# Altium project ESP6266.PrjPcb
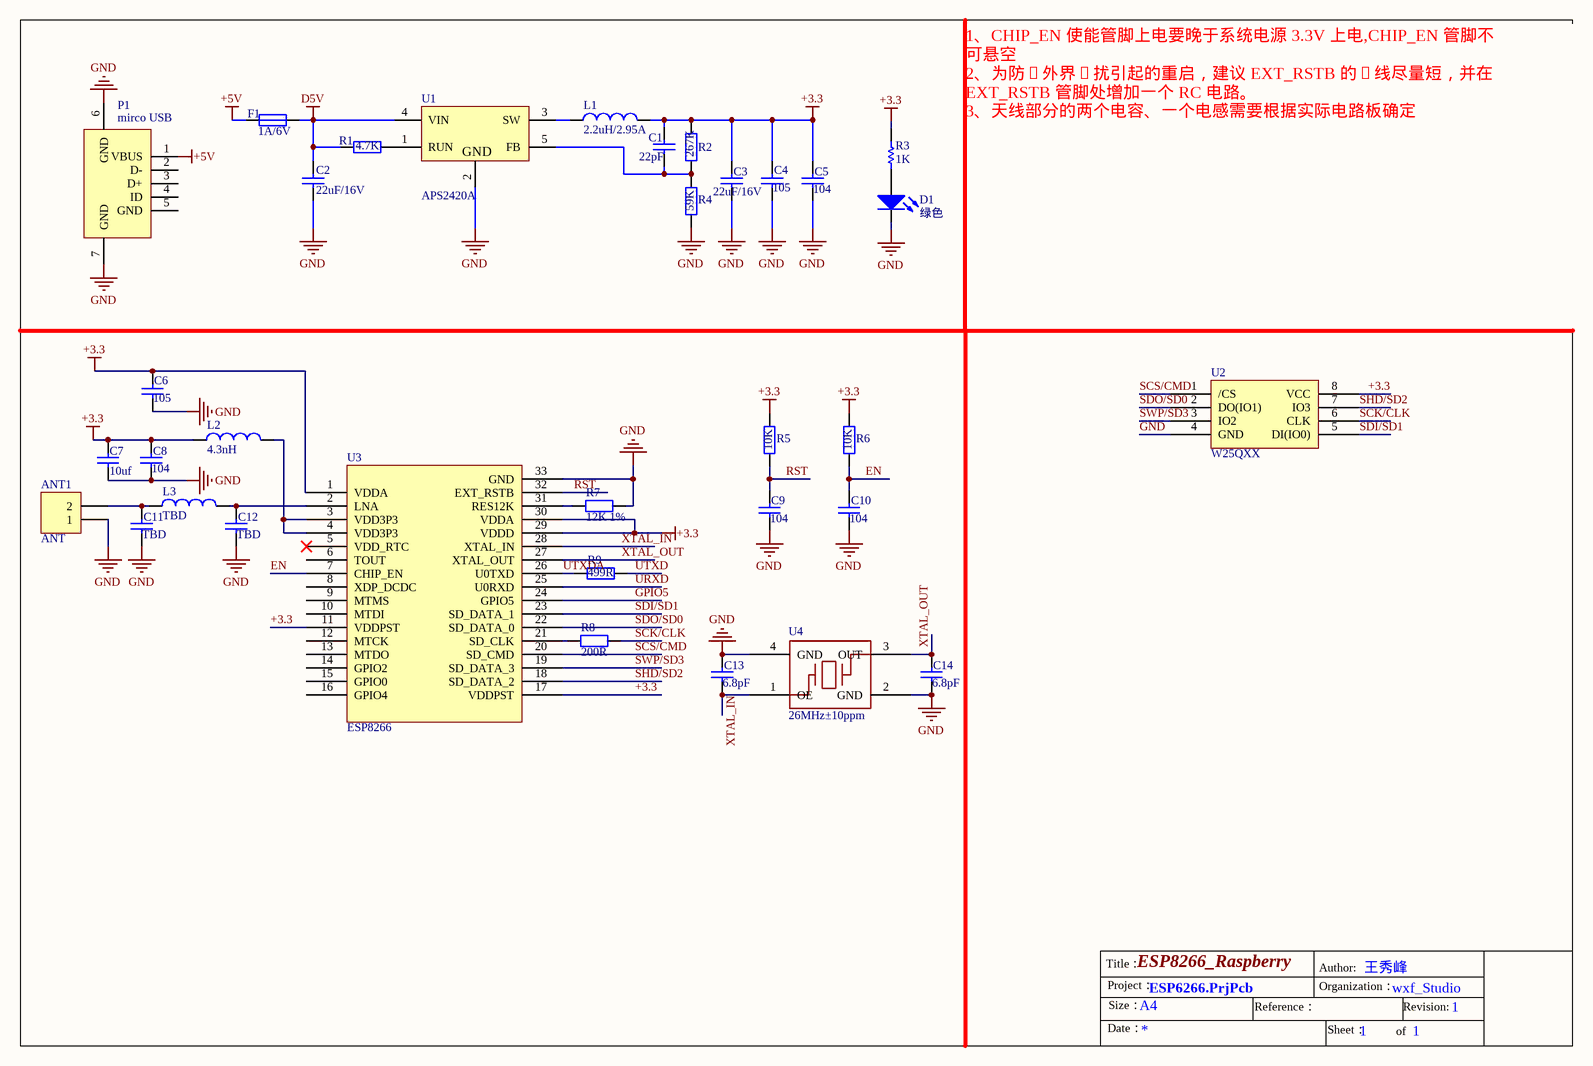
[diagram p0: ESP8266.SchDoc]
1 sheet, 34 parts. Net scope: global (net labels, ports and power ports of the same name join across sheets).

## Sheet ESP8266.SchDoc: ESP8266_Raspberry
size A4; Author: 王秀峰; Organization: wxf_Studio; Address1: shanghai; Address2: minhang; Address3: lianhang road  1188; Revision: 1; SheetNumber: 1; SheetTotal: 1; Sheet Size: A4

### Parts
ANT1  ANT  [HDR1X2]
C1  22pF  [0603_C]
C2  22uF/16V  [1206_C]
C3  22uF/16V  [1206_C]
C4  105  [0603_C]
C5  104  [0603_C]
C6  105  [0603_C]
C7  10uf  [1206_C]
C8  104  [0603_C]
C9  104  [0603_C]
C10  104  [0603_C]
C11  TBD  [0603_C]
C12  TBD  [0603_C]
C13  6.8pF  [0603_C]
C14  6.8pF  [0603_C]
D1  绿色  [0603_LED_S1]
F1  1A/6V  [1206_R]
L1  2.2uH/2.95A  [4030]
L2  4.3nH  [0402-A]
L3  TBD  [0402-A]
P1  mirco USB  [micro USB 贴]
R1  4.7K  [0603_R]
R2  267K  [0603_R]
R3  1K  [0603_R]
R4  59K  [0603_R]
R5  10K  [0603_R]
R6  10K  [0603_R]
R7  12K 1%  [0603_R]
R8  200R  [0603_R]
R9  499R  [0603_R]
U1  APS2420A  [SOT-23-5]
U2  W25QXX  [SOIC-8_208mil]
U3  ESP8266  [ESP8266EX]
U4  26MHz±10ppm  [3225]

### Nets
+3.3: C1.2 C3.2 C4.2 C5.2 C6.2 C7.2 C8.2 L1.2 L2.1 R2.1 R3.1 R5.1 R6.1 U2.8(VCC) U3.1(VDDA) U3.11(VDDPST) U3.17(VDDPST) U3.29(VDDD) U3.30(VDDA)
+5V: F1.1 P1.1(VBUS)
D5V: C2.2 F1.2 R1.1 U1.4(VIN)
GND: ANT1.1 C2.1 C3.1 C4.1 C5.1 C6.1 C7.1 C8.1 C9.1 C10.1 C11.1 C12.1 C13.2 C14.1 D1.2(K) P1.6(GND) P1.7(GND) R4.2 R7.2 U1.2(GND) U2.4(GND) U3.33(GND) U4.2(GND) U4.4(GND)
EN: C10.2 R6.2 U3.7(CHIP_EN)
GPIO5: U3.24(GPIO5)
RST: C9.2 R5.2 U3.32(EXT_RSTB)
SCK/CLK: R8.2 U2.6(CLK)
SCS/CMD: U2.1(/CS) U3.20(SD_CMD)
SDI/SD1: U2.5(DI(IO0)) U3.23(SD_DATA_1)
SDO/SD0: U2.2(DO(IO1)) U3.22(SD_DATA_0)
SHD/SD2: U2.7(IO3) U3.18(SD_DATA_2)
SWP/SD3: U2.3(IO2) U3.19(SD_DATA_3)
URXD: U3.25(U0RXD)
UTXD: R9.2
UTXDA: R9.1 U3.26(U0TXD)
XTAL_IN: C13.1 U3.28(XTAL_IN) U4.1(OE)
XTAL_OUT: C14.2 U3.27(XTAL_OUT) U4.3(OUT)
NetANT1_2: ANT1.2 C11.2 L3.1
NetC1_1: C1.1 R2.2 R4.1 U1.5(FB)
NetC12_2: C12.2 L3.2 U3.2(LNA)
NetD1_1: D1.1(A) R3.2
NetL1_1: L1.1 U1.3(SW)
NetL2_2: L2.2 U3.3(VDD3P3) U3.4(VDD3P3)
NetR1_2: R1.2 U1.1(RUN)
NetR7_1: R7.1 U3.31(RES12K)
NetR8_1: R8.1 U3.21(SD_CLK)

Not connected (* = marked no-connect by the designer): P1 2(D-) 3(D+) 4(ID) 5(GND); U3 5(VDD_RTC)* 6(TOUT) 8(XDP_DCDC) 9(MTMS) 10(MTDI) 12(MTCK) 13(MTDO) 14(GPIO2) 15(GPIO0) 16(GPIO4)

### Notes on the sheet
- 1、CHIP_EN 使能管脚上电要晚于系统电源 3.3V 上电,CHIP_EN 管脚不
  可悬空
  2、为防⽌外界⼲扰引起的重启，建议 EXT_RSTB 的⾛线尽量短，并在 EXT_RSTB 管脚处增加一个 RC 电路。
  3、天线部分的两个电容、一个电感需要根据实际电路板确定
- Title：
- Project：
- Author:
- Organization：
- Date：
- Size：
- Reference：
- Sheet：
- of
- Revision:

### Library data of the parts
ANT1 = Header 2: Header, 2-Pin; LatestRevisionDate: 17-Jul-2002; LatestRevisionNote: Re-released for DXP Platform.; Publisher: Altium Limited
C1 = Cap_Nonpolar: 无极性电容; 型号: CC0603JRNPO9BN220; 品牌: YAGEO(国巨); 商品编号: C105620
C2 C3 = Cap_Nonpolar: 无极性电容; 型号: CC1206KKX5R6BB226; 品牌: YAGEO(国巨); 商品编号: C1934
C4 C6 = Cap_Nonpolar: 无极性电容; 型号: CC0603KRX5R8BB105; 品牌: YAGEO(国巨); 商品编号: C14664
C5 C8-C12 = Cap_Nonpolar: 无极性电容; 型号: CC0603KRX7R7BB104; 品牌: YAGEO(国巨); 商品编号: C108079
C7 = Cap_Nonpolar: 无极性电容; 型号: CL10A106KP8NNNC; 品牌: SAMSUNG(三星); 商品编号: C19702
C13 C14 = Cap_Nonpolar: 无极性电容; 型号: 0603CG6R8C500NT; 品牌: FH(风华); 商品编号: C1679
D1 = LED-G: 绿色LED; pin to pad: 1>A 2>K; 型号: LTST-S270KRKT; 品牌: LITEON(台湾光宝); 商品编号: C125114
F1 = FUSE: 自恢复保险丝; 型号: SMD1206P100TF; 品牌: RUILON(瑞隆源); 商品编号: C20800
L1 = Inductor: 电感; 型号: SWPA4030S2R2MT; 品牌: Sunlord(顺络); 商品编号: C36409
L2 = Inductor: 品牌: muRata(村田); 厂家型号: LQG15HS4N3S02D; 商品编号: C97999
L3 = Inductor: 品牌: Sunlord(顺络); 厂家型号: SDCL1608C2N2STDF; 商品编号: C29682
P1 = Micro USB: mirco  USB 立; pin to pad: 6>0 7>0; 型号: U-F-M5DD-Y-L; 品牌: 韩国韩荣; 商品编号: C91146
R1 = Res: 型号: RC0603FR-074K7L; 品牌: YAGEO(国巨); 商品编号: C99782
R2 = Res: 型号: RC0603FR-07267KL; 品牌: YAGEO(国巨); 商品编号: C185347
R3 = Res1: Resistor; 型号: 0603WAF1001T5E; 品牌: UNI-ROYAL(厚声); 商品编号: C21190
R4 = Res: 型号: RC0603DR-0759KL; 品牌: YAGEO(国巨); 商品编号: C137811
R5 R6 = Res: 型号: RC0805FR-0710KL; 品牌: YAGEO(国巨); 商品编号: C84376
R7 = Res: 型号: RS-03K1202FT; 品牌: FH(风华); 商品编号: C136587
R8 = Res: 型号: AC0603JR-07200RL; 品牌: YAGEO(国巨); 商品编号: C144619
R9 = Res: 型号: RS-03K4990FT; 品牌: FH(风华); 商品编号: C140086
U1 = APS2420A: 型号: APS2420ATBER; 品牌: chipown(芯朋微电子); 商品编号: C130331